# Altium schematic sheet mcu_connector.SchDoc
size A4; SheetNumber: 1; SheetTotal: 1
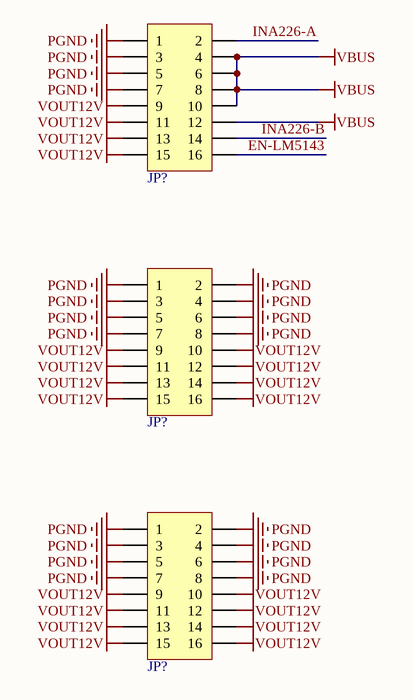
[diagram p0: mcu_connector.SchDoc]

## Parts
(Parts that share a designator on the sheet are numbered #1, #2 ... from top to bottom, then left to right.)
JP?#1  Header 8X2  [HDR2.54-LI-2x8P]  (value not drawn)
JP?#2  Header 8X2  [HDR2.54-LI-2x8P]  (value not drawn)
JP?#3  Header 8X2  [HDR2.54-LI-2x8P]  (value not drawn)

## Nets
PGND: JP?#1.1 JP?#1.3 JP?#1.5 JP?#1.7 JP?#2.1 JP?#2.2 JP?#2.3 JP?#2.4 JP?#2.5 JP?#2.6 JP?#2.7 JP?#2.8 JP?#3.1 JP?#3.2 JP?#3.3 JP?#3.4 JP?#3.5 JP?#3.6 JP?#3.7 JP?#3.8
VBUS: JP?#1.4 JP?#1.6 JP?#1.8 JP?#1.10 JP?#1.12
VOUT12V: JP?#1.9 JP?#1.11 JP?#1.13 JP?#1.15 JP?#2.9 JP?#2.10 JP?#2.11 JP?#2.12 JP?#2.13 JP?#2.14 JP?#2.15 JP?#2.16 JP?#3.9 JP?#3.10 JP?#3.11 JP?#3.12 JP?#3.13 JP?#3.14 JP?#3.15 JP?#3.16
EN-LM5143: JP?#1.16
INA226-A: JP?#1.2
INA226-B: JP?#1.14

## Library data of the parts
JP?#1-JP?#3 = Header 8X2: 8*2P接插件; 版权归属: 源创客; BOM名称: 8*2P接插件; 学习资源: www.ooocke.com